# EAGLE schematic FSWSJE2IZ6BVKJ2 (EAGLE 9.5.2)
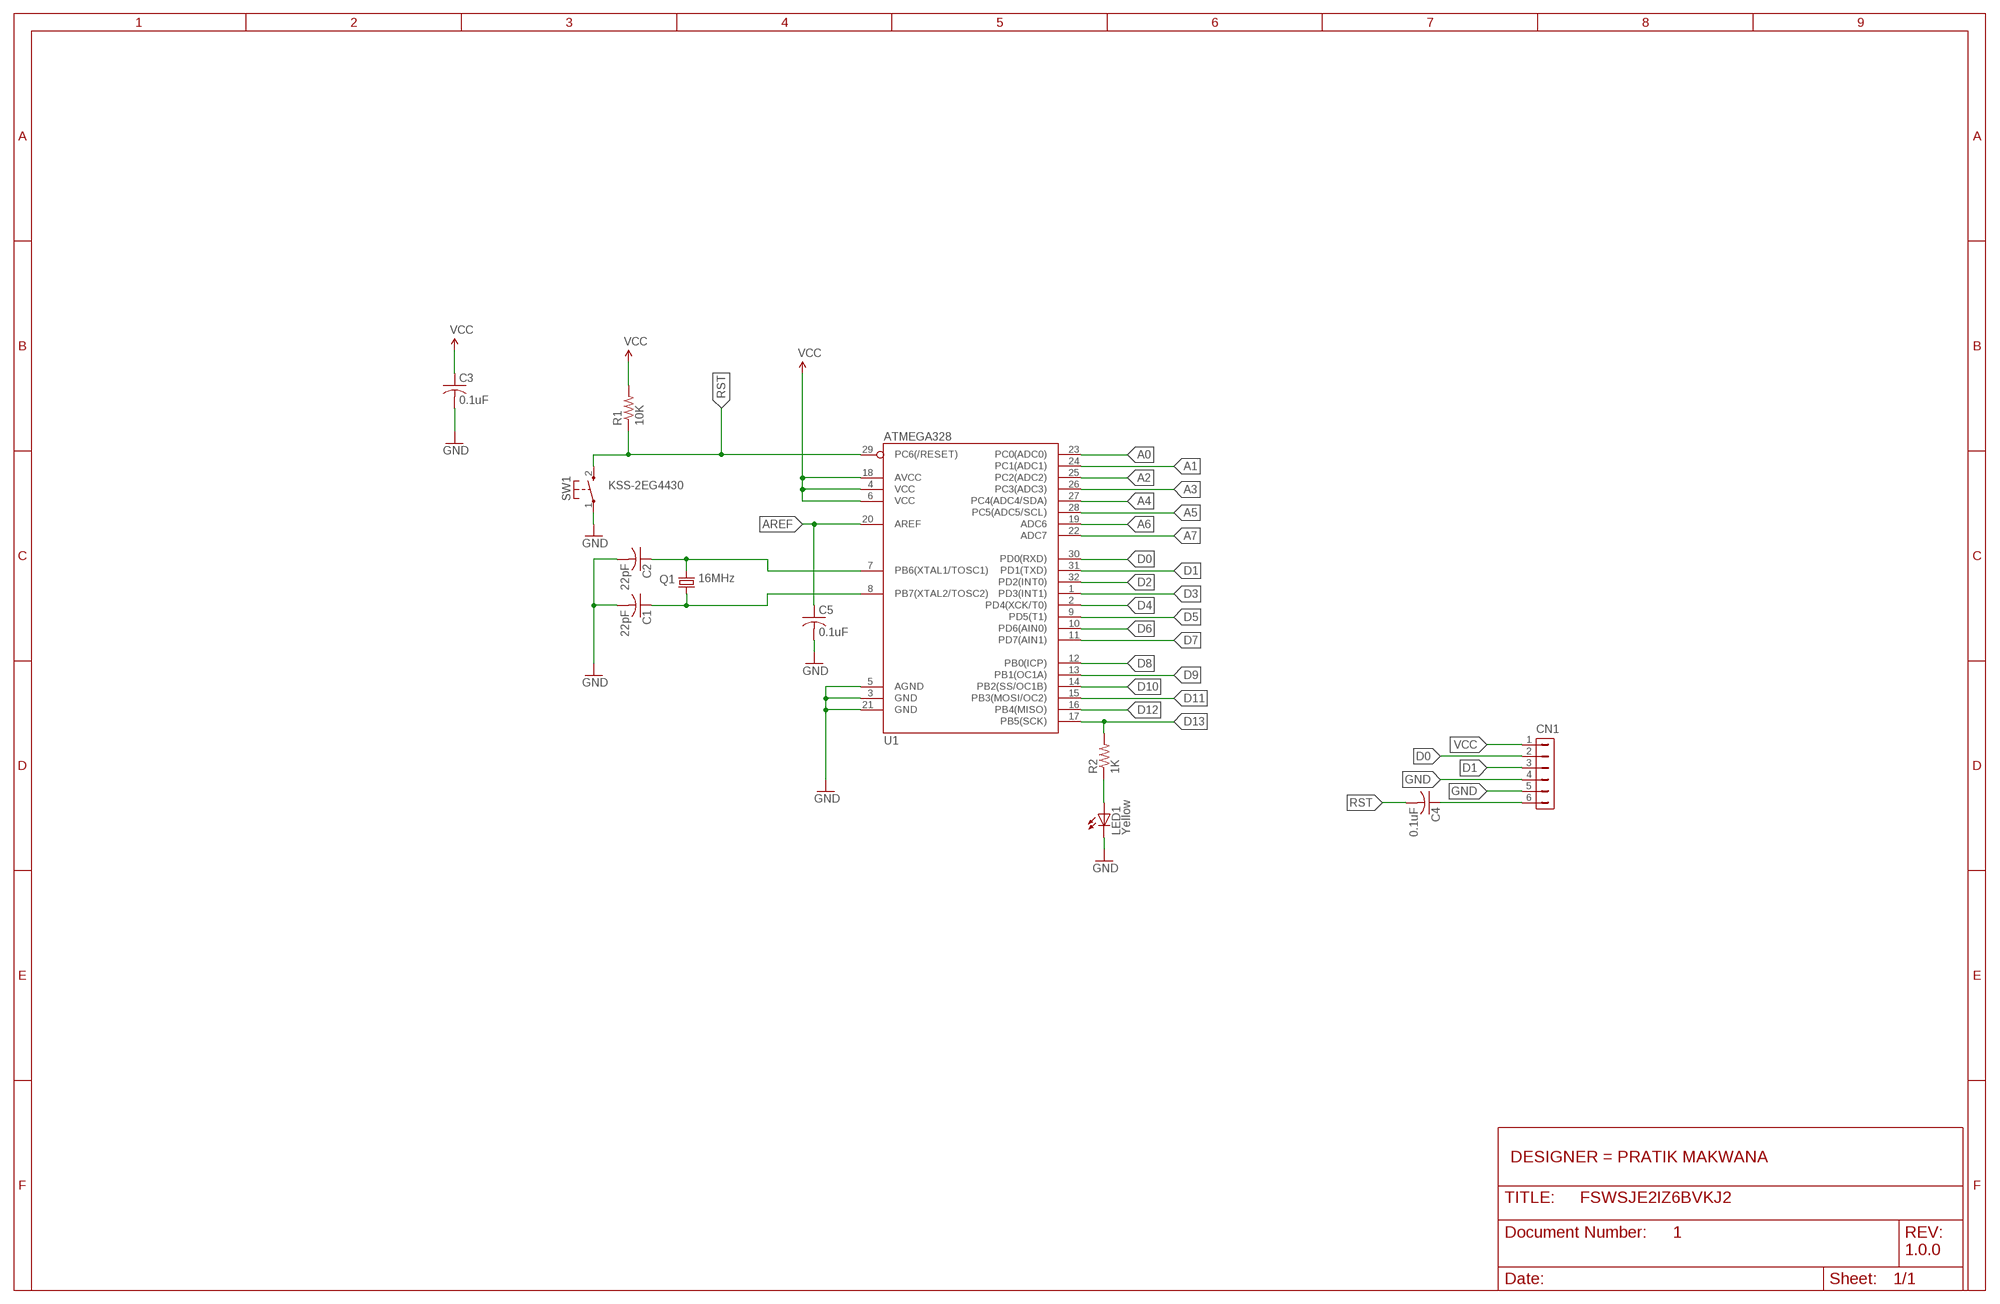
[diagram p0: schematic, sheet 1]
FRAME1 (FRAME_B_L): DESIGNER: PRATIK MAKWANA; DOC: 1; REV: 1.0.0

## Parts
C1  22pF  C-USC1206  [C1206]
C2  22pF  C-USC1206  [C1206]
C3  0.1uF  C-USC0805  [C0805]
C4  0.1uF  C-USC0805  [C0805]
C5  0.1uF  C-USC0805  [C0805]
CN1  HDR-1X6-SIP-100  [SIP-100-6V]
LED1  Yellow  LEDCHIP-LED0805  [CHIP-LED0805]
Q1  16MHz  CRYTALHC49S  [HC49/S]
R1  10K  R-US_R1206  [R1206]
R2  1K  R-US_R1206  [R1206]
SW1  KSS-2EG4430  [KSS-2EG4430]
U1  ATMEGA328  [TQFP32-08]

## Nets
A0: U1.23(PC0(ADC0))
A1: U1.24(PC1(ADC1))
A2: U1.25(PC2(ADC2))
A3: U1.26(PC3(ADC3))
A4: U1.27(PC4(ADC4/SDA))
A5: U1.28(PC5(ADC5/SCL))
A6: U1.19(ADC6)
A7: U1.22(ADC7)
AREF: C5.1 U1.20(AREF)
D0: CN1.2 U1.30(PD0(RXD))
D1: CN1.3 U1.31(PD1(TXD))
D2: U1.32(PD2(INT0))
D3: U1.1(PD3(INT1))
D4: U1.2(PD4(XCK/T0))
D5: U1.9(PD5(T1))
D6: U1.10(PD6(AIN0))
D7: U1.11(PD7(AIN1))
D8: U1.12(PB0(ICP))
D9: U1.13(PB1(OC1A))
D10: U1.14(PB2(SS/OC1B))
D11: U1.15(PB3(MOSI/OC2))
D12: U1.16(PB4(MISO))
D13: R2.2 U1.17(PB5(SCK))
GND: C1.2 C2.2 C3.2 C5.2 CN1.4 CN1.5 LED1.C SW1.1(P) U1.3(GND) U1.5(AGND) U1.21(GND)
N$6: C4.1 CN1.6
N$43: C2.1 Q1.2 U1.7(PB6(XTAL1/TOSC1))
N$44: C1.1 Q1.1 U1.8(PB7(XTAL2/TOSC2))
N$50: LED1.A R2.1
RST: C4.2 R1.1 SW1.2(S) U1.29(PC6(/RESET))
VCC: C3.1 CN1.1 R1.2 U1.4(VCC) U1.6(VCC) U1.18(AVCC)

## Library data of the parts
C1-C5 = adafruit:C-US: CAPACITOR, American symbol
CN1 = con-hdrs40:HDR-1X6: HEADER CONNECTOR
LED1 = adafruit:LED: LED OSRAM: - CHIPLED LG R971, LG N971, LY N971, LG Q971, LY Q971, LO R971, LY R971 LH N974, LH R974 LS Q976, LO Q976, LY Q976 LO Q996 - Hyper CHIPLED LW Q18S LB Q993, LB Q99A, LB R99A - SideLED LS A670, LO A670, LY A670, LG A670, LP A670 LB A673, LV A673, LT A673, LW A673 LH A674 LY A675 LS A676, LA A676, LO A676, LY A676, LW A676 LS A679, LY A679, LG A679 - Hyper Micro SIDELED® LS Y876, LA Y876, LO Y876, LY Y876 LT Y87S - SmartLED LW L88C, LW L88S LB L89C, LB L89S, LG L890 LS L89K, LO L89K, LY L89K LS L896, LA L896, LO L896, LY L896 - TOPLED LS T670, LO T670, LY T670, LG T670, LP T670 LSG T670, LSP T670, LSY T670, LOP T670, LYG T670 LG T671, LOG T671, LSG T671 LB T673, LV T673, LT T673, LW T673 LH T674 LS T676, LA T676, LO T676, LY T676, LB T676, LH T676, LSB T676, LW T676 LB T67C, LV T67C, LT T67C, LS T67K, LO T67K, LY T67K, LW E67C LS E67B, LA E67B, LO E67B, LY E67B, LB E67C, LV E67C, LT E67C LW T67C LS T679, LY T679, LG T679 LS T770, LO T770, LY T770, LG T770, LP T770 LB T773, LV T773, LT T773, LW T773 LH T774 LS E675, LA E675, LY E675, LS T675 LS T776, LA T776, LO T776, LY T776, LB T776 LHGB T686 LT T68C, LB T68C - Hyper Mini TOPLED® LB M676 - Mini TOPLED Santana® LG M470 LS M47K, LO M47K, LY M47K Source: http://www.osram.convergy.de/
Q1 = crystal:CRYTAL: CRYSTAL
R1 R2 = adafruit:R-US_: RESISTOR, American symbol
SW1 = buttons:KSS-2EG4430: Size: 3x6mm Height: 5mm from PCB Rating: DC12v 50mA Travel: 0.25±0.10mm Operating Force: 180±50gf Return Force: 60gf min Contact resistance: 100m? max Insulation resistance: 100M? min Operating life?50,000 cycles
U1 = thecustomgeek:ATMEGA328: ATmega328P-AU TQFP 32 pin